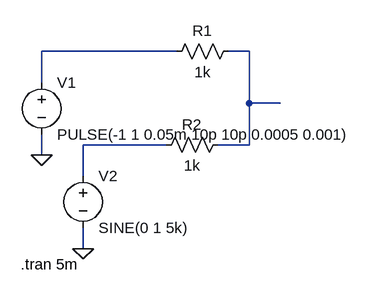
[diagram p0: schematic summator.asc]
summator.asc, the LTspice schematic file:
Version 4
SHEET 1 880 680
WIRE 256 48 48 48
WIRE 368 48 336 48
WIRE 48 96 48 48
WIRE 368 128 368 48
WIRE 416 128 368 128
WIRE 240 192 112 192
WIRE 368 192 368 128
WIRE 368 192 320 192
WIRE 48 208 48 176
WIRE 112 240 112 192
WIRE 112 352 112 320
FLAG 48 208 0
FLAG 112 352 0
SYMBOL voltage 48 80 R0
WINDOW 123 0 0 Left 2
WINDOW 39 0 0 Left 2
SYMATTR InstName V1
SYMATTR Value PULSE(-1 1 0.05m 10p 10p 0.0005 0.001)
SYMBOL voltage 112 224 R0
WINDOW 123 0 0 Left 2
WINDOW 39 0 0 Left 2
SYMATTR InstName V2
SYMATTR Value SINE(0 1 5k)
SYMBOL res 352 32 R90
WINDOW 0 0 56 VBottom 2
WINDOW 3 32 56 VTop 2
SYMATTR InstName R1
SYMATTR Value 1k
SYMATTR SpiceLine tol=5
SYMBOL res 336 176 R90
WINDOW 0 0 56 VBottom 2
WINDOW 3 32 56 VTop 2
SYMATTR InstName R2
SYMATTR Value 1k
SYMATTR SpiceLine tol=5
TEXT 16 376 Left 2 !.tran 5m

The netlist it stands for:
* summator.asc
V1 N001 0 PULSE(-1 1 0.05m 10p 10p 0.0005 0.001)
V2 N003 0 SINE(0 1 5k)
R1 N002 N001 1k tol=5
R2 N002 N003 1k tol=5
.tran 5m
.backanno
.end